# EAGLE design Schaltplan (EAGLE 7.2.0)
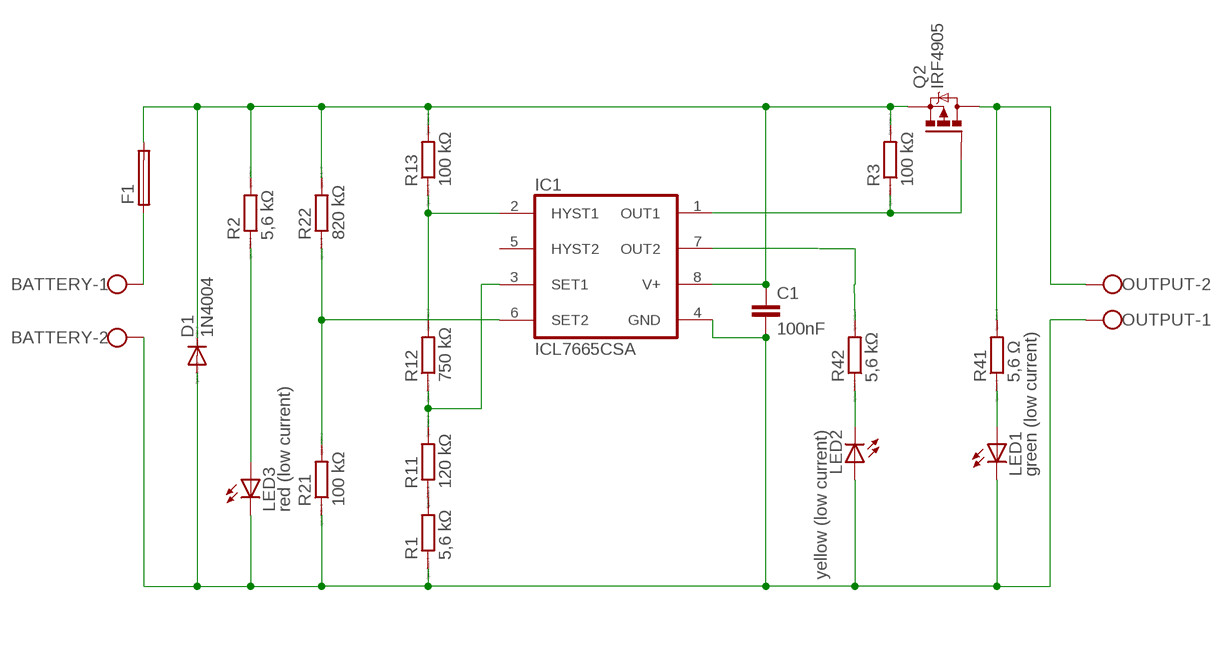
[diagram p0: schematic, sheet 1]

## Parts
BATTERY  W237-102  [W237-102]
C1  100nF  C-EUC0603  [C0603]
D1  1N4004  [DO41-10]
F1  GSH15  [GSH15]
IC1  ICL7665CSA  [SO08]
LED1  green (low current)  LEDSML0603  [SML0603]
LED2  yellow (low current)  LEDKA-3528ASYC  [KA-3528ASYC]
LED3  red (low current)  LEDKA-3528ASYC  [KA-3528ASYC]
OUTPUT  W237-102  [W237-102]
Q2  IRF4905  [TO220BH]
R1  5,6 kΩ  RR1206  [R1206]
R2  5,6 kΩ  RR1206  [R1206]
R3  100 kΩ  RR1206  [R1206]
R11  120 kΩ  RR1206  [R1206]
R12  750 kΩ  RR1206  [R1206]
R13  100 kΩ  RR1206  [R1206]
R21  100 kΩ  RR1206  [R1206]
R22  820 kΩ  RR1206  [R1206]
R41  5,6 Ω  RR1206  [R1206]
R42  5,6 kΩ  RR1206  [R1206]

## Nets
GND: BATTERY.2 C1.2 D1.A IC1.4(GND) LED1.C LED2.A LED3.C OUTPUT.1 R1.1 R21.1
N$1: LED3.A R2.1
N$2: IC1.6(SET2) R21.2 R22.1
N$3: IC1.2(HYST1) R12.2 R13.1
N$4: OUTPUT.2 Q2.D R41.2
N$5: IC1.7(OUT2)
N$6: IC1.3(SET1) R11.2 R12.1
N$7: IC1.1(OUT1) Q2.G R3.1
N$9: LED1.A R41.1
N$10: R42.2
N$16: LED2.C R42.1
N$17: R1.2 R11.1
N$18: BATTERY.1 F1.1
POWER: C1.1 D1.C F1.2 IC1.8(V+) Q2.S R2.2 R3.2 R13.2 R22.2
Unconnected: IC1.5(HYST2)

## Library data of the parts
BATTERY OUTPUT = con-wago-500:W237-102: WAGO SCREW CLAMP; MPN: 237-102; OC_FARNELL: unknown; OC_NEWARK: 70K9898
C1 = resistor:C-EU: CAPACITOR, European symbol
D1 = diode:1N4004: DIODE general purpose rectifier, 1 A
F1 = fuse:GSH15: FUSE HOLDER grid 15mm, 19649 Wickmann; MPN: 64900001039; OC_FARNELL: 1271673; OC_NEWARK: 02P0318
IC1 = maxim:ICL7665CSA: UNDER/OVER VOLTAGE DETECTOR; MPN: ICL7665CSA+; OC_FARNELL: unknown; OC_NEWARK: 19M9537
LED1-LED3 = led:LED: LED OSRAM: - CHIPLED LG R971, LG N971, LY N971, LG Q971, LY Q971, LO R971, LY R971 LH N974, LH R974 LS Q976, LO Q976, LY Q976 LO Q996 - Hyper CHIPLED LW Q18S LB Q993, LB Q99A, LB R99A - SideLED LS A670, LO A670, LY A670, LG A670, LP A670 LB A673, LV A673, LT A673, LW A673 LH A674 LY A675 LS A676, LA A676, LO A676, LY A676, LW A676 LS A679, LY A679, LG A679 - Hyper Micro SIDELED® LS Y876, LA Y876, LO Y876, LY Y876 LT Y87S - SmartLED LW L88C, LW L88S LB L89C, LB L89S, LG L890 LS L89K, LO L89K, LY L89K LS L896, LA L896, LO L896, LY L896 - TOPLED LS T670, LO T670, LY T670, LG T670, LP T670 LSG T670, LSP T670, LSY T670, LOP T670, LYG T670 LG T671, LOG T671, LSG T671 LB T673, LV T673, LT T673, LW T673 LH T674 LS T676, LA T676, LO T676, LY T676, LB T676, LH T676, LSB T676, LW T676 LB T67C, LV T67C, LT T67C, LS T67K, LO T67K, LY T67K, LW E67C LS E67B, LA E67B, LO E67B, LY E67B, LB E67C, LV E67C, LT E67C LW T67C LS T679, LY T679, LG T679 LS T770, LO T770, LY T770, LG T770, LP T770 LB T773, LV T773, LT T773, LW T773 LH T774 LS E675, LA E675, LY E675, LS T675 LS T776, LA T776, LO T776, LY T776, LB T776 LHGB T686 LT T68C, LB T68C - Hyper Mini TOPLED® LB M676 - Mini TOPLED Santana® LG M470 LS M47K, LO M47K, LY M47K Source: http://www.osram.convergy.de LUXEON: - LUMILED® LXK2-PW12-R00, LXK2-PW12-S00, LXK2-PW14-U00, LXK2-PW14-V00 LXK2-PM12-R00, LXK2-PM12-S00, LXK2-PM14-U00 LXK2-PE12-Q00, LXK2-PE12-R00, LXK2-PE12-S00, LXK2-PE14-T00, LXK2-PE14-U00 LXK2-PB12-K00, LXK2-PB12-L00, LXK2-PB12-M00, LXK2-PB14-N00, LXK2-PB14-P00, LXK2-PB14-Q00 LXK2-PR12-L00, LXK2-PR12-M00, LXK2-PR14-Q00, LXK2-PR14-R00 LXK2-PD12-Q00, LXK2-PD12-R00, LXK2-PD12-S00 LXK2-PH12-R00, LXK2-PH12-S00 LXK2-PL12-P00, LXK2-PL12-Q00, LXK2-PL12-R00 Source: www.luxeon.com KINGBRIGHT: KA-3528ASYC Source: www.kingbright.com
Q2 = transistor-power:IRF4905: P-Channel HEXFET® Power MOSFET RDS(on)= 0.02 Ohm, ID = -74A Source: http://www.irf.com/product-info/datasheets/data/irf4905pbf.pdf
R1-R3 R11-R13 R21 R22 R41 R42 = eagle-ltspice:R: RESISTOR, European symbol; SPICEMODEL: NONE; SPICEPREFIX: R

## Board
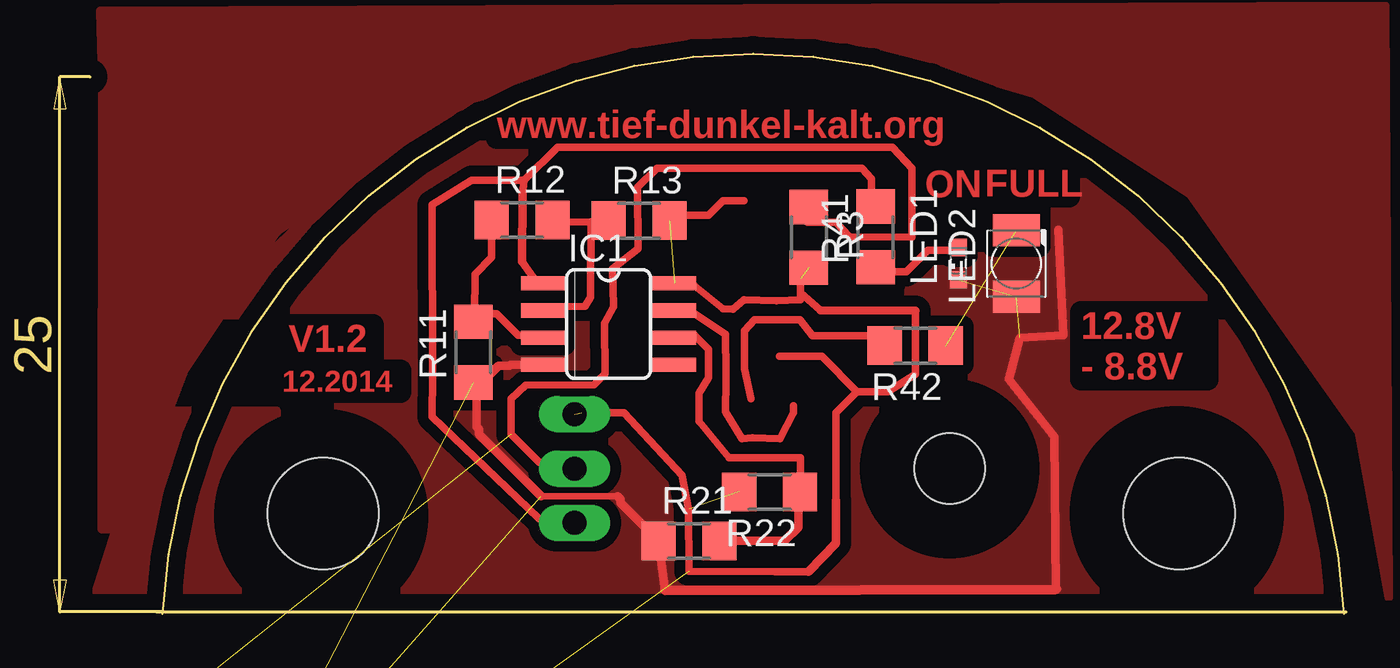
[diagram p1: board, top side]
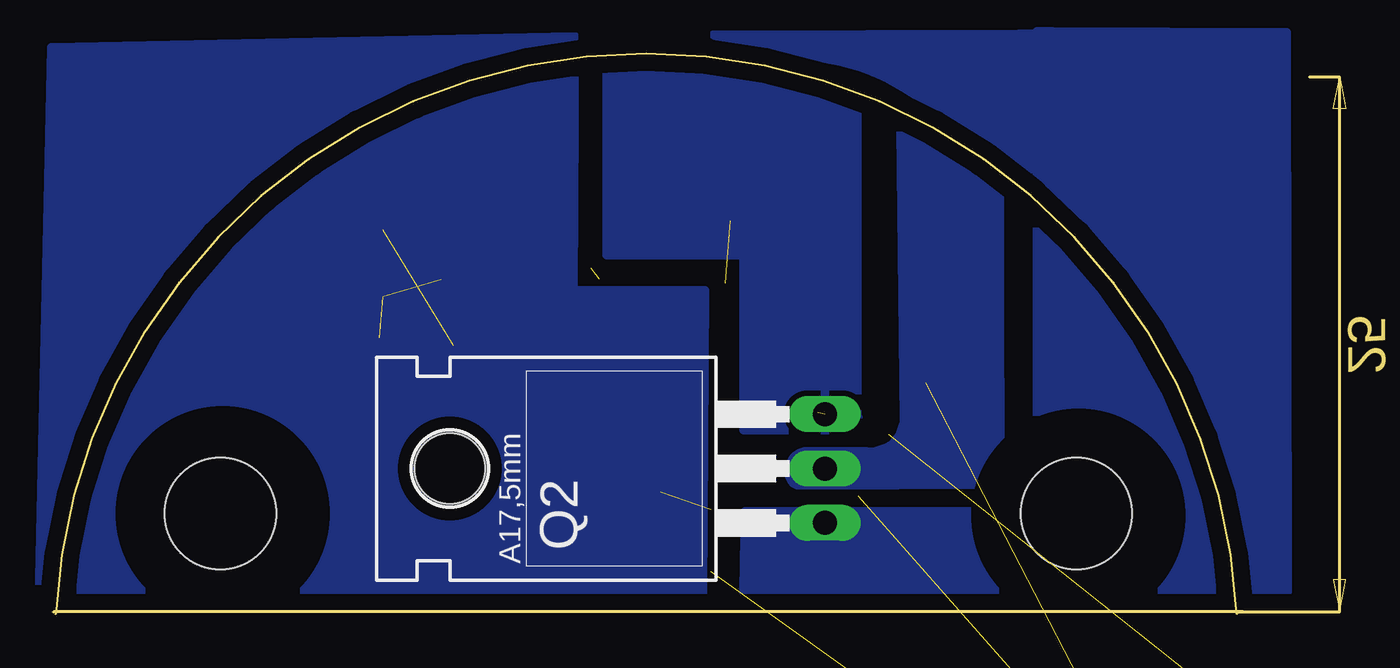
[diagram p2: board, bottom side, seen from below]

Size 55.5 x 26.19 mm. Coordinates in mm from the lower left corner, seen from the top.
Outline: 0,0.1 55.5,0.1
Outline: 0.2,0 arc-174 55.4,0
Copper layers (1*16): Top 0.035mm / dielectric 1.5mm / Bottom 0.035mm
Design rules "default *": minimum track width 14mil, minimum drill 24mil, track to track 20mil, track to pad 20mil, pad to pad 20mil, via to via 20mil, smd to smd 8mil, copper to edge 30mil, drill to drill 8mil, minimum pad ring 10mil, minimum via ring 8mil, stop-mask expansion 4mil, vias tented up to drill 0mil, thermal gap 10mil
Holes 5.2 mm at 7.7,4.7 47.7,4.7
tRestrict: area 2.6,-0.4 to 12.6,9.6; area 42.6,-0.3 to 52.6,9.7
bRestrict: area 42.6,-0.3 to 52.6,9.7; area 2.6,-0.4 to 12.6,9.6

### Footprints (pad centres in the part's own frame; a part is rotated, then mirrored left to right if it is on the bottom)
W237-102 = drill 1.194 long: 1 -2.5,-1.27; 2 2.5,-1.27
C0603 = smd 1.1 x 1: 1 -0.85,0; 2 0.85,0
DO41-10 = drill 1.118: A 5.08,0; C -5.08,0
GSH15 = drill 1.321 pad 2.54 long: 1 -7.62,0; 2 7.62,0 | hole 2.794: 0,0
SO08 = smd 0.66 x 2.032: 1 -1.905,-3.073; 2 -0.635,-3.073; 3 0.635,-3.073; 4 1.905,-3.073; 5 1.905,3.073; 6 0.635,3.073; 7 -0.635,3.073; 8 -1.905,3.073
SML0603 = smd 0.8 x 0.8: A 0.75,0; C -0.75,0
KA-3528ASYC = smd 1.5 x 2.2: A -1.55,0; C 1.55,0
TO220BH = drill 1.118 long: D 0,-6.35; G -2.54,-6.35; S 2.54,-6.35 | hole 3.302: 0,11.176
R1206 = smd 1.6 x 1.803: 1 -1.422,0; 2 1.422,0

### Placement (x,y rotation side)
BATTERY  -12.64,-19.56 0 top  (outside the outline)
C1  -6.03,-20.65 0 top  (outside the outline)
D1  -21.7,-44.35 0 top  (outside the outline)
F1  -15.18,-53.65 0 top  (outside the outline)
IC1  21.04,13.55 270 top
LED1  37.4,16.38 90 top
LED2  40.09,16.37 90 top
LED3  -25.41,-31.29 0 top  (outside the outline)
OUTPUT  -22.77,-19.56 0 top  (outside the outline)
Q2  25.8,6.8 90 bottom
R1  -5.04,-24.64 0 top  (outside the outline)
R2  -25.34,-37.95 0 top  (outside the outline)
R3  30.4,17.6 270 top
R11  14.72,12.24 90 top
R12  17,18.41 0 top
R13  22.46,18.38 0 top
R21  24.8,3.42 0 top
R22  28.56,5.71 180 top
R41  33.51,17.62 90 top
R42  35.37,12.54 180 top
U$1  PIN-GENERIC  [LEER]  -5.8,-17.3 0 top  (outside the outline)

### Tracks (layer width: path | path; a pad name or v marks a point on that pad's centre or on a via)
GND  (8 unrouted)
  Top 0.305: 17.89,5.51 21.45,5.51
  Top 0.406: IC1.4 16.46,11.64 16.42,11.61 15.89,11.61 14.87,10.59 14.87,8.76 15,8.64 15,8.41 17.89,5.51 | 21.45,5.51 21.6,5.36 21.6,5.19 R21.1 23.68,1.12 | 41.95,1.17 41.87,8.28 39.74,10.97 40.27,12.9 42.3,13.03 42.05,17.96
  Top 0.457: 23.68,1.12 41.95,1.17
  pour Top (no thermals): -0.1,0.1 55.5,0.1 55.41,26 0.4,25.84
N$1  (1 unrouted)
N$2
  Top 0.356: 30.14,6.1 30.01,6.58 30.01,7.31 26.66,7.31 25.26,9.02 25.26,10.31 25.72,11.05 25.72,12.37 25.06,13.03 24.4,13.03 IC1.6
  Top 0.406: R21.2 29.26,3.42 29.91,4.06 29.91,5.63 R22.1 29.6,6.1 30.14,6.1
N$3
  Top 0.254: 18.19,14.19 IC1.2
  Top 0.356: 18.07,14.22 IC1.2 18.12,14.35 19.95,14.38 20.2,14.81 20.23,18.34 | 20.23,18.34 18.66,18.31 R12.2 | 20.23,18.34 R13.1
N$4  (1 unrouted)
  Top 0.356: R41.2 33.31,19.3 33.31,20.35 32.88,20.83 23.3,20.83 22.39,19.94 22.41,17.07 21.22,16.13 21.27,14.35 20.84,13.59 20.87,11.23 20.36,10.72 17.16,10.69 16.47,10.06 16.47,8.41 17.79,7.09 19.44,7.09 Q2.D
  pour Bottom (no thermals): 11.26,6.05 20.7,6 arc90 21.1,6.7 21.1,6.8 arc90 20.3,7.6 17.5,7.6 arc-90 15.76,9.01 15.96,26.61 11.3,26
N$5
  Top 0.356: 29.68,9.73 29.68,9.4 29.04,8.2 27.77,8.23 27.27,8.2 26.5,9.45 26.53,10.95 26.53,11.28 26.5,13.08 25.06,14.02 24.4,14.02 IC1.7
N$6
  Top 0.356: 14.49,14.02 14.77,13.99 14.79,15.87 15.58,16.66 R12.1 | 14.49,14.02 14.49,13.69 R11.2 14.49,14.02 | 14.49,14.02 15.81,14.02 16.8,13.03 17.79,13.03 IC1.3
N$7
  Top 0.356: 17.03,19.63 17.08,20.27 | 17.08,20.27 18.66,21.82 34.3,21.82 35.22,20.83 35.22,17.6 32.3,17.63 31.66,18.31 30.34,18.31 R3.1 | 17,16.46 17.79,15.34 IC1.1 | 17.08,20.27 14.64,20.27 12.79,19.13 12.81,11.12 12.79,9.22 17.79,4.45 19.44,4.45 Q2.G
  Top 0.406: 17.03,19.63 17,16.46
  pour Bottom (no thermals): 23.18,4.8 9.63,4.8 9.8,20.3 10.1,27.09 0.75,27.06 0.2,0.1 23.28,-0.1
N$9
  Top 0.356: LED1.A 37.27,16.99 35.95,16.99 34.96,16 33.64,16 R41.1
N$10
  Top 0.356: 27.7,10.06 27.39,11.46 27.39,13.23 27.85,13.74 29.98,13.74 30.57,13 33.69,13 33.67,12.8 33.64,12.04 33.97,12.37 R42.2
N$11
  pour Top: -2.63,24.64 -2.65,3.96 -1.61,3.94 1.23,11.4 5.52,17.86 14.69,24.08 25.39,26.85 32.22,26.85 40.91,24.31 48.25,19.58 56.1,8.51 57.49,0.76 57.34,28.42 -2.71,28.19 -2.65,25.76
N$12
  pour Top: 2.55,13.97 11.65,13.92 12.2,13.92 12.2,23.55 2.58,14.35
N$13
  pour Bottom: 10.1,21.03 15.79,24.59 arc-34 21.12,26.01 arc38 24.68,27.08 10.38,27.1 9.41,27.13 9.38,21.03 9.74,20.68
N$14
  pour Top: 5.52,9.5 -0.22,9.5 -2.99,0.86 -2.53,0.94 -2.27,1.07 12.74,1.12 6.24,3.53 5.55,9.45
N$15
  pour Bottom: 9.54,27.23 9.54,1.04 -2.17,1.04 -2.12,27.18 8.83,27.23
N$16  (1 unrouted)
N$17  (1 unrouted)
N$18  (1 unrouted)
POWER  (8 unrouted)
  Top 0.356: 27.37,19.3 26.38,19.3 25.72,18.64 24.07,18.64 R13.2 | 29.02,12.04 31,12.04 32.65,10.39 | 32.65,10.39 34.1,10.39 35.37,11.2 35.37,14.17 | 30.01,15.01 30.95,14.2 | 30.01,15.67 30.01,15.01 | 30.01,15.01 30.01,14.68 28.89,14.63 27.37,14.68 26.86,14.25 26.38,14.27 25.06,15.34 24.4,15.34 IC1.8 | 19.77,9.4 21.75,9.4 24.47,6.48 24.78,4.9 24.8,2.01 28.82,1.98 30.39,1.98 | 31.66,5.31 31.66,9.4 32.65,10.39
  Top 0.406: 30.39,1.98 31.66,3.3 31.66,5.31 | 30.95,14.2 35.37,14.17
  pour Bottom: 17.92,9.3 arc90 18.27,8.58 23.25,8.58 23.25,16.76 29.65,16.76 29.65,26.36 17.92,26.36
S$1
  pour Bottom (no thermals): 25.06,15.13 25.14,0.86 56.2,0.61 55.6,26.49 31.13,26.99 31.19,15.15

### Text on the board
Top: www.tief-dunkel-kalt.org | ON | FULL | V1.2 | 12.2014 | 12.8V / - 8.8V